# EAGLE design tinyheader (EAGLE 6.5.0)
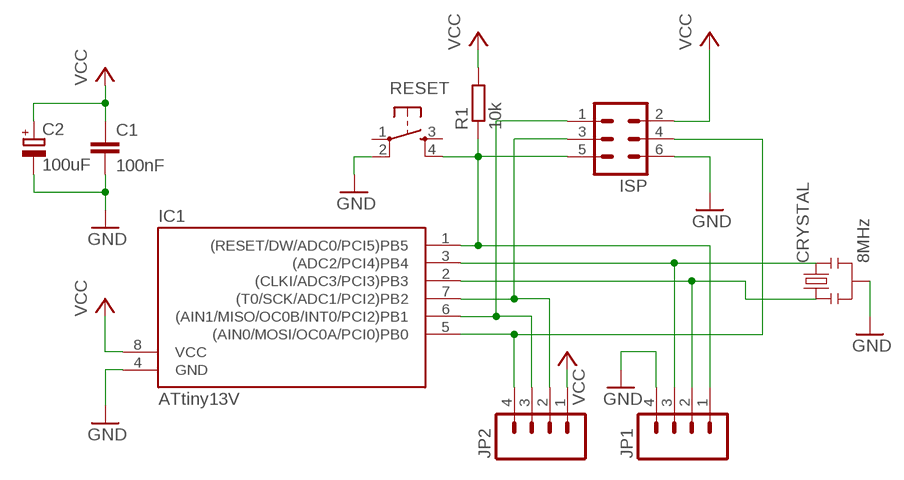
[diagram p0: schematic, sheet 1]

## Parts
C1  100nF  C-EU025-025X050  [C025-025X050]
C2  100uF  CPOL-EUE2,5-6E  [E2,5-6E]
CRYSTAL  8MHz  RESONATORPTH  [RESONATOR-PTH]
IC1  ATtiny13V  ATTINY13-20P  [DIL08]
ISP  MA03-2  [MA03-2]
JP1  M04PTH  [1X04]
JP2  M04PTH  [1X04]
R1  10k  R-EU_0207/5V  [0207/5V]
RESET  TAC_SWITCHSND  [TACTILE_SWITCH_SMD]

## Nets
GND: C1.2 C2.- CRYSTAL.2 IC1.4(GND) ISP.6 JP1.4 RESET.2
N$2: CRYSTAL.1 IC1.2((CLKI/ADC3/PCI3)PB3) JP1.2
N$4: IC1.1((RESET/DW/ADC0/PCI5)PB5) ISP.5 JP1.1 R1.1 RESET.4
N$5: IC1.7((T0/SCK/ADC1/PCI2)PB2) ISP.3 JP2.2
N$6: IC1.6((AIN1/MISO/OC0B/INT0/PCI2)PB1) ISP.1 JP2.3
N$8: CRYSTAL.3 IC1.3((ADC2/PCI4)PB4) JP1.3
N$10: IC1.5((AIN0/MOSI/OC0A/PCI0)PB0) ISP.4 JP2.4
VCC: C1.1 C2.+ IC1.8(VCC) ISP.2 JP2.1 R1.2
Unconnected: RESET.1 RESET.3

## Library data of the parts
C1 = rcl:C-EU: CAPACITOR, European symbol; MF: VISHAY/SPRAGUE; MPN: 1C20Z5U104M050B; OC_NEWARK: 17F2165
C2 = rcl:CPOL-EU: POLARIZED CAPACITOR, European symbol; MPN: 100YXF100MEFC12.5X20; OC_NEWARK: 54T4432
CRYSTAL = SparkFun:RESONATOR: Resonator Small SMD resonator. This is the itty bitty 10/20MHz resonators with built in caps. CSTCE10M0G55 and CSTCE20M0V53. Footprint has been reviewed closely but hasn't been tested yet.; MPN: C8M000000L004; OC_NEWARK: 58M4718
IC1 = avr:ATTINY13: MICROCONTROLLER 1 Kbytes FLASH 64 bytes EEPROM 64 bytes RAM 4-channel 10 bit ADC; MPN: ATTINY13V-10PU; OC_NEWARK: 68T3519
ISP = con-lstb:MA03-2: PIN HEADER; OC_NEWARK: unknown
JP1 JP2 = SparkFun:M04: Header 4 Standard 4-pin 0.1" header. Use with straight break away headers (SKU : PRT-00116), right angle break away headers (PRT-00553), swiss pins (PRT-00743), machine pins (PRT-00117), and female headers (PRT-00115). Molex polarized connector foot print use with SKU : PRT-08231 with associated crimp pins and housings.; OC_NEWARK: unknown
R1 = rcl:R-EU_: RESISTOR, European symbol; MF: FARNELL; MPN: MCF 0.5W 10K; OC_NEWARK: 38K0259
RESET = SparkFun:TAC_SWITCH: Momentary Switch Button commonly used for reset or general input. Spark Fun Electronics SKU : COM-00097; OC_NEWARK: unknown

## Board
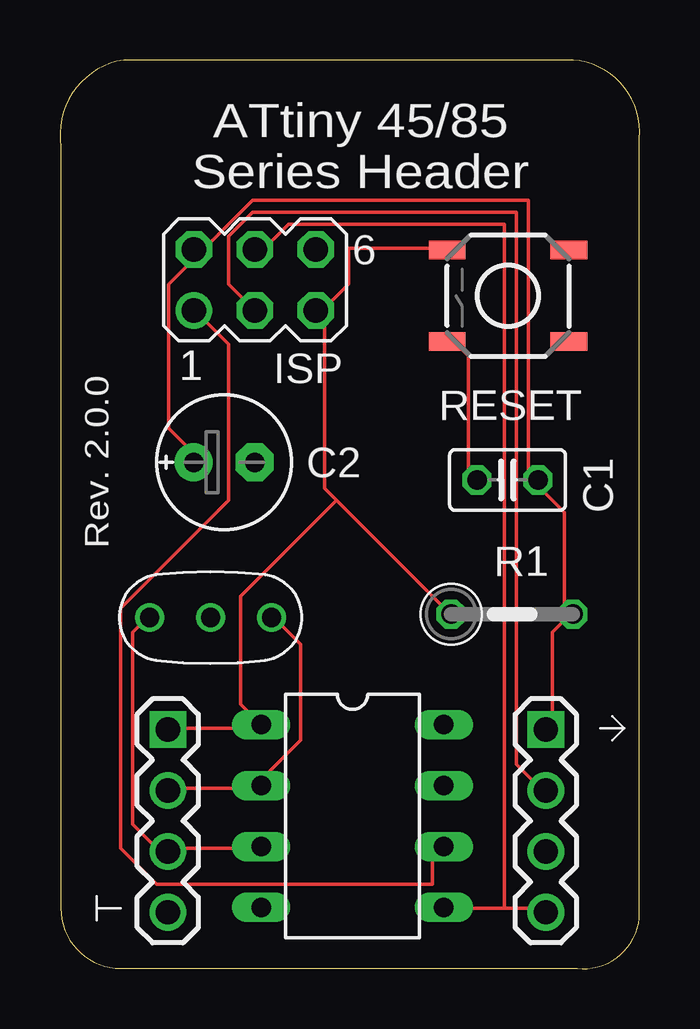
[diagram p1: board, top side]
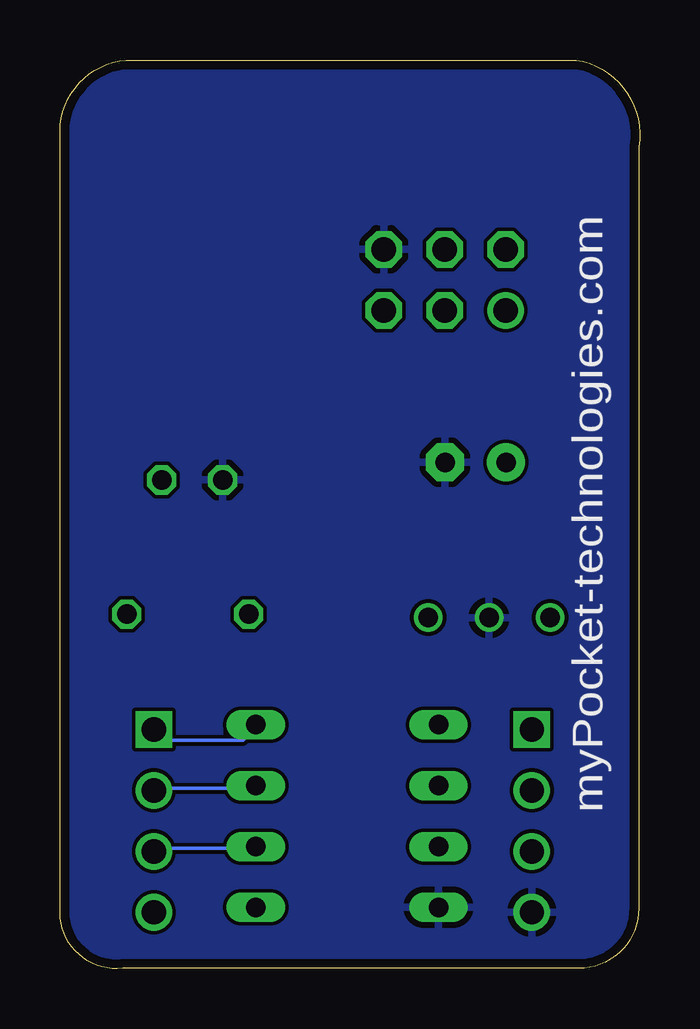
[diagram p2: board, bottom side, seen from below]

Size 24.17 x 37.87 mm. Coordinates in mm from the lower left corner, seen from the top.
Outline: 0.04,34.25 0.04,2.51 arc90 2.54,0.01 21.56,0.01 arc90 24.16,2.11 24.16,34.61 arc90 21.4,37.87 2.65,37.87 arc90 0.04,34.25
Copper layers (1*16): Top 0.0356mm / dielectric 1.5011mm / Bottom 0.0356mm
Design rules "LaenPCBOrder": minimum track width 6mil, minimum drill 13mil, track to track 6mil, track to pad 6mil, pad to pad 6mil, via to via 6mil, smd to smd 6mil, copper to edge 15mil, drill to drill 6mil, minimum pad ring 7mil, minimum via ring 7mil, stop-mask expansion 4mil, vias tented up to drill 0mil, thermal gap 10mil

### Footprints (pad centres in the part's own frame; a part is rotated, then mirrored left to right if it is on the bottom)
C025-025X050 = drill 0.813 octagon: 1 -1.27,0; 2 1.27,0
E2,5-6E = drill 0.813 pad 1.575: + -1.27,0 | drill 0.813 pad 1.575 octagon: - 1.27,0
RESONATOR-PTH = drill 0.8: 1 -2.54,0; 2 0,0; 3 2.54,0
DIL08 = drill 0.813 long: 1 -3.81,-3.81; 2 -1.27,-3.81; 3 1.27,-3.81; 4 3.81,-3.81; 5 3.81,3.81; 6 1.27,3.81; 7 -1.27,3.81; 8 -3.81,3.81
MA03-2 = drill 1.016: 1 -2.54,-1.27 | drill 1.016 octagon: 2 -2.54,1.27; 3 0,-1.27; 4 0,1.27; 5 2.54,-1.27; 6 2.54,1.27
1X04 = drill 1.016 square: 1 0,0 | drill 1.016: 2 2.54,0; 3 5.08,0; 4 7.62,0
0207/5V = drill 0.813 octagon: 1 -2.54,0; 2 2.54,0
TACTILE_SWITCH_SMD = smd 1.524 x 0.762: 1 -2.54,1.905; 2 2.54,1.905; 3 -2.54,-1.905; 4 2.54,-1.905

### Placement (x,y rotation side)
C1  18.66,20.37 180 top
C2  6.85,21.1 0 top
CRYSTAL  6.28,14.63 180 top
IC1  12.2,6.36 270 top
ISP  8.13,28.7 0 top
JP1  4.5,9.97 270 top
JP2  20.26,9.97 270 top
R1  18.85,14.77 0 top
RESET  18.68,28.04 180 top

### Tracks (layer width: path | path; a pad name or v marks a point on that pad's centre or on a via)
GND
  Top 0.152: RESET.2 16.54,26.01 17.04,25.51 17.04,20.51 C1.2
  pour Bottom: -0.46,39.51 26.04,39.51 26.04,-0.49 -0.46,-0.49 -0.46,0.51
N$2
  Top 0.152: CRYSTAL.1 9.04,14.51 10.04,13.51 10.04,9.51 8.54,8.01 IC1.2 8.04,7.51 4.54,7.51 JP1.2
N$4
  Top 0.152: JP1.1 4.54,10.01 8.04,10.01 IC1.1 8.04,10.51 7.54,11.01 7.54,15.51 11.54,19.51 | RESET.4 16.04,30.01 12.04,30.01 12.04,28.51 11.04,27.51 ISP.5 11.04,27.01 11.04,20.01 11.54,19.51 | 11.54,19.51 16.04,15.01 R1.1
N$5
  Top 0.152: ISP.3 8.04,27.51 7.04,28.51 7.04,30.51 8.04,31.51 19.04,31.51 19.04,8.51 20.04,7.51 JP2.2
  Bottom 0.152: IC1.7 16.04,7.51 20.04,7.51 JP2.2
N$6
  Top 0.152: ISP.1 6.04,27.01 7.04,26.01 7.04,19.51 2.54,15.01 2.54,5.01 4.04,3.51 15.54,3.51 15.54,5.01 IC1.6
  Bottom 0.152: IC1.6 16.04,5.01 20.04,5.01 JP2.3
N$8
  Top 0.152: CRYSTAL.3 3.54,14.51 3.04,14.01 3.04,6.01 4.04,5.01 JP1.3 4.54,5.01 8.04,5.01 IC1.3
N$10
  Top 0.152: 18.54,2.51 20.04,2.51 JP2.4 | 18.54,2.51 16.04,2.51 IC1.5 | 18.54,2.51 18.54,31.01 9.54,31.01 8.54,30.01 ISP.4
VCC
  Top 0.152: C2.+ 5.54,21.51 4.54,22.51 4.54,28.51 5.54,29.51 ISP.2 6.04,30.01 8.04,32.01 19.54,32.01 19.54,20.51 C1.1 20.04,20.01 21.04,19.01 21.04,15.01 R1.2 21.04,14.51 20.54,14.01 20.54,10.01 JP2.1
  Bottom 0.152: IC1.8 16.04,10.01 16.54,9.51 20.04,9.51 JP2.1

### Text on the board
tNames: ATtiny 45/85 / Series Header | Rev. 2.0.0
bNames: myPocket-technologies.com